# Altium schematic sheet p2_eth_rs232.SchDoc
size A1; Organization: Protel International P/L; Address1: L3, 12a Rodborough Rd; Address2: Frenchs Forest; Address3: NSW; Address4: Australia 2086
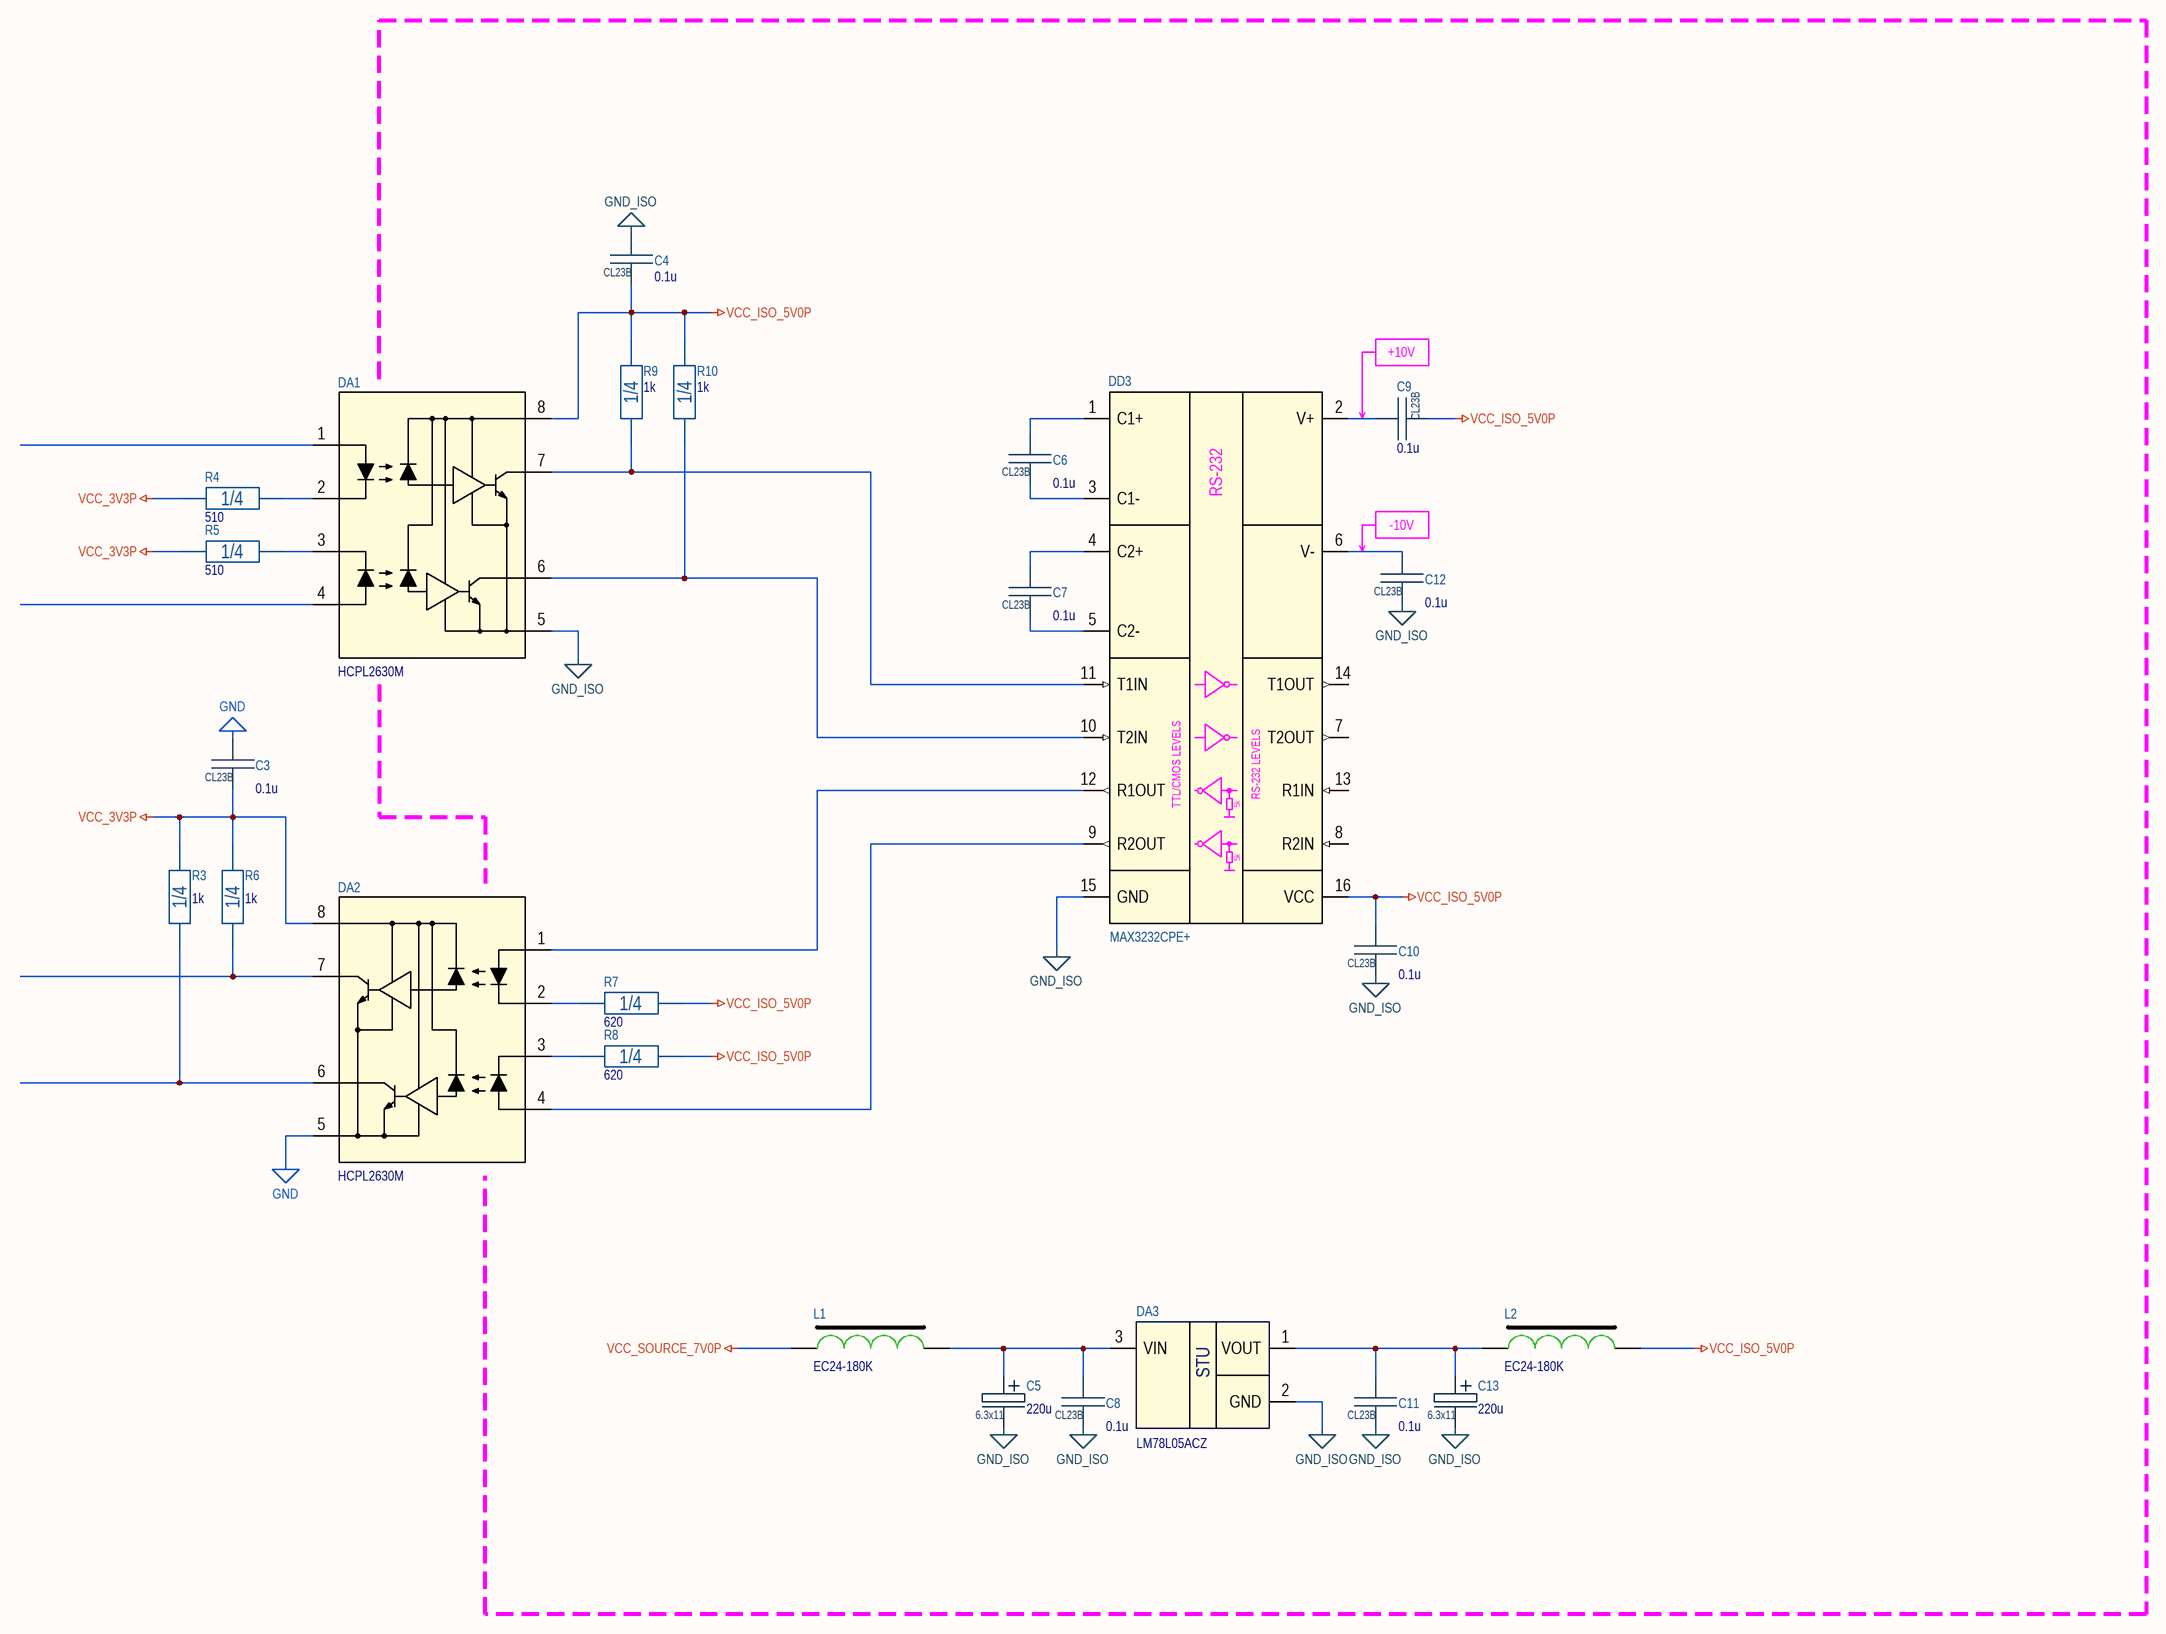
[diagram p0: p2_eth_rs232.SchDoc]

## Parts
C3  0.1u  [CL23B_7.2x2.5]
C4  0.1u  [CL23B_7.2x2.5]
C5  220u  Package: 6.3x11  [ECAP6.3X11X2.5_BRW]
C6  0.1u  [CL23B_7.2x2.5]
C7  0.1u  [CL23B_7.2x2.5]
C8  0.1u  [CL23B_7.2x2.5]
C9  0.1u  [CL23B_7.2x2.5]
C10  0.1u  [CL23B_7.2x2.5]
C11  0.1u  [CL23B_7.2x2.5]
C12  0.1u  [CL23B_7.2x2.5]
C13  220u  Package: 6.3x11  [ECAP6.3X11X2.5_BRW]
DA1  HCPL2630M  [DIP-8P-M01]
DA2  HCPL2630M  [DIP-8P-M01]
DA3  LM78L05ACZ  [TO-92 (VERTICAL,LINE)]
DD3  MAX3232CPE+  [DIP-16P-M03]
L1  EC24-180K  [EC24_GREEN]
L2  EC24-180K  [EC24_GREEN]
R3  1k  Package: 1/4  [CFR-25]
R4  510  Package: 1/4  [CFR-25]
R5  510  Package: 1/4  [CFR-25]
R6  1k  Package: 1/4  [CFR-25]
R7  620  Package: 1/4  [CFR-25]
R8  620  Package: 1/4  [CFR-25]
R9  1k  Package: 1/4  [CFR-25]
R10  1k  Package: 1/4  [CFR-25]

## Nets
GND: C3.1 DA2.5(GND)
GND_ISO: C4.1 C5.2 C8.2 C10.2 C11.2 C12.2 C13.2 DA1.5(GND) DA3.2(GND) DD3.15(GND)
VCC_3V3P: C3.2 DA2.8(VCC) R3.1 R4.1 R5.1 R6.1
VCC_ISO_5V0P: C4.2 C9.2 C10.1 DA1.8(VCC) DD3.16(VCC) L2.2 R7.1 R8.1 R9.1 R10.1
VCC_SOURCE_7V0P: L1.1
NetC5_1: C5.1 C8.1 DA3.3(VIN) L1.2
NetC6_1: C6.1 DD3.1(C1+)
NetC6_2: C6.2 DD3.3(C1-)
NetC7_1: C7.1 DD3.4(C2+)
NetC7_2: C7.2 DD3.5(C2-)
NetC9_1: C9.1 DD3.2(V+)
NetC11_1: C11.1 C13.1 DA3.1(VOUT) L2.1
NetC12_1: C12.1 DD3.6(V-)
NetDA1_2: DA1.2(CATHODE1) R4.2
NetDA1_3: DA1.3(CATHODE2) R5.2
NetDA1_6: DA1.6(V02) DD3.10(T2IN) R10.2
NetDA1_7: DA1.7(V01) DD3.11(T1IN) R9.2
NetDA2_1: DA2.1(ANODE1) DD3.12(R1OUT)
NetDA2_2: DA2.2(CATHODE1) R7.2
NetDA2_3: DA2.3(CATHODE2) R8.2
NetDA2_4: DA2.4(ANODE2) DD3.9(R2OUT)
NetDA2_6: DA2.6(V02) R3.2
NetDA2_7: DA2.7(V01) R6.2

Not connected (* = marked no-connect by the designer): DA1 1(ANODE1) 4(ANODE2); DD3 7(T2OUT) 8(R2IN) 13(R1IN) 14(T1OUT)

## Notes on the sheet
- +10V
- -10V
- Title
- Size:
- Date:
- File:
- A1
- Number:
- Time:
- Revision:
- Sheet
- of
- (in symbol LM78L05ACZ) STU
- (in symbol MAX3232CPE+) RS-232; TTL/CMOS LEVELS; RS-232 LEVELS; 5k

## Library data of the parts
C3 C4 C6-C12 = CL23B: Box-type metallized polyester film capacitor; Tolerance: ± * %; Voltage: 63V; Value: 0.1u; Dielectric: Polyester; Value on schem: 0.1u; Part Number: *; Manufacturer: *; Package: CL23B
C5 C13 = C_ECAP: Aluminium capacitor; Part Number: EKZH160ELL221MF11D; Manufacturer: Nichicon; Tolerance: ± 20 %; Voltage: 16V; Value: 220u; Value on schem: 220u
DA1 DA2 = HCPL2630M: Dual-Channel High-Speed 10 MBit/s Logic Gate Optocouplers; Manufacturer: ON Semiconductor; Package: DIP-8; Part Number: HCPL2630M
DA3 = LM78L05ACZ: 100-mA Fixed Output Linear Regulator; Manufacturer: Texas Instruments; Part Number: LM78L05ACZ; Package: TO-92
DD3 = MAX3232CPE+: 3.0V to 5.5V, Low-Power, Up to 1Mbps, True RS-232 Transceivers; Manufacturer: Maxim Integrated; Part Number: MAX3232CPE+; Package: DIP-16
L1 L2 = EC24: Axial leaded coated inductors; Manufacturer: 3L Electronic; RDC: 1 Ohm; SRF Min: 15 MHz; Q: 40; Irms  Max: 315 mA; Inductance @ 100 kHz: 18 µH; Part Number: EC24-180K; Package: EC24
R3 R6 R9 R10 = CF25: Resistor 1/4W; Part Number: MFR-25FTF52-1K; Manufacturer: Yageo; Tolerance: ± 1 %; Voltage: 250V; Temperature Coefficient: ±100 ppm/°C; Value: 1k; Value on schem: 1k
R4 R5 = CF25: Resistor 1/4W; Part Number: MFR-25FTF52-510R; Manufacturer: Yageo; Tolerance: ± 1 %; Voltage: 250V; Temperature Coefficient: ±100 ppm/°C; Value: 510; Value on schem: 510
R7 R8 = CF25: Resistor 1/4W; Part Number: MFR-25FTF52-620R; Manufacturer: Yageo; Tolerance: ± 1 %; Voltage: 250V; Temperature Coefficient: ±100 ppm/°C; Value: 620; Value on schem: 620